# EAGLE design adapter_bluetooth (EAGLE 5.11)
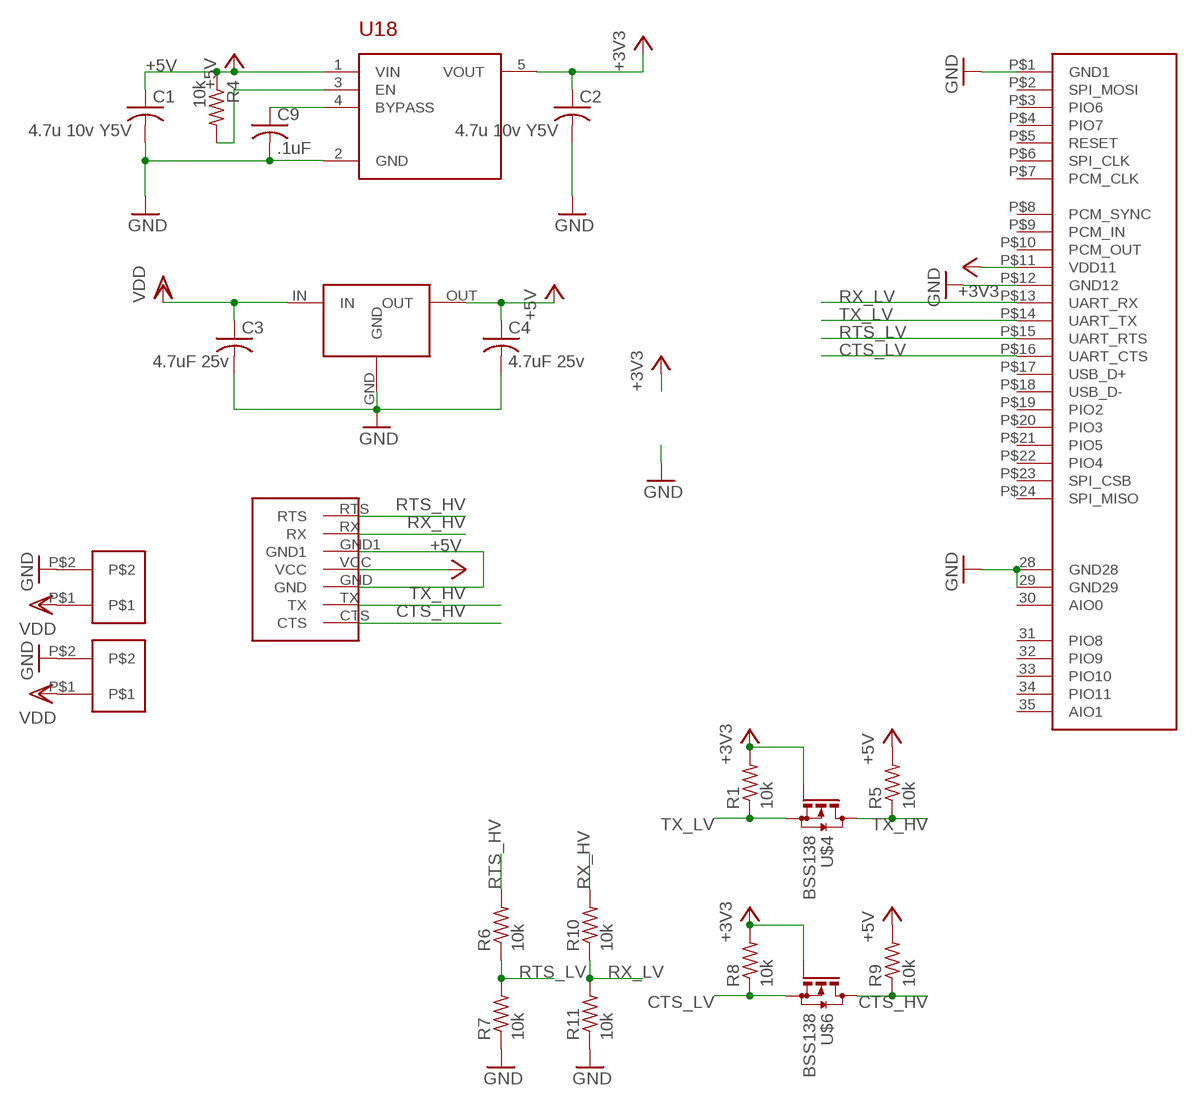
[diagram p0: schematic, sheet 1]

## Parts
C1  4.7u 10v Y5V  C-USC0603  [C0603]
C2  4.7u 10v Y5V  C-USC0603  [C0603]
C3  4.7uF 25v  C-USC0603  [C0603]
C4  4.7uF 25v  C-USC0603  [C0603]
C9  .1uF  C-USC0603  [C0603]
R1  10k  R-US_R0603  [R0603]
R4  10k  R-US_R0603  [R0603]
R5  10k  R-US_R0603  [R0603]
R6  10k  R-US_R0603  [R0603]
R7  10k  R-US_R0603  [R0603]
R8  10k  R-US_R0603  [R0603]
R9  10k  R-US_R0603  [R0603]
R10  10k  R-US_R0603  [R0603]
R11  10k  R-US_R0603  [R0603]
U18  LDS3985XX33  [SOT23-5]
U$1  RN-41  [RN-41]
U$2  L78MXXC  [DPAK]
U$3  2P  [2PTH]
U$4  BSS138  [SOT23]
U$6  BSS138  [SOT23]
U$10  WASP7PIN  [WASP7PIN]
U$19  2P  [2PTH]

## Nets
+3V3: C2.1 R1.2 R8.2 U18.5(VOUT) U$1.P$11(VDD11) U$4.1(G) U$6.1(G)
+5V: C1.1 C4.1 R4.1 R5.2 R9.2 U18.1(VIN) U$2.OUT U$10.VCC
CTS_HV: R9.1 U$6.3(D) U$10.CTS
CTS_LV: R8.1 U$1.P$16(UART_CTS) U$6.2(S)
GND: C1.2 C2.2 C3.2 C4.2 C9.2 R7.1 R11.1 U18.2(GND) U$1.28(GND28) U$1.29(GND29) U$1.P$1(GND1) U$1.P$12(GND12) U$2.GND U$3.P$2 U$10.GND U$10.GND1 U$19.P$2
N$2: R4.2 U18.3(EN)
N$3: C9.1 U18.4(BYPASS)
RTS_HV: R6.2 U$10.RTS
RTS_LV: R6.1 R7.2 U$1.P$15(UART_RTS)
RX_HV: R10.2 U$10.RX
RX_LV: R10.1 R11.2 U$1.P$13(UART_RX)
TX_HV: R5.1 U$4.3(D) U$10.TX
TX_LV: R1.1 U$1.P$14(UART_TX) U$4.2(S)
VDD: C3.1 U$2.IN U$3.P$1 U$19.P$1
Unconnected: U$1.30(AIO0) U$1.31(PIO8) U$1.32(PIO9) U$1.33(PIO10) U$1.34(PIO11) U$1.35(AIO1) U$1.P$2(SPI_MOSI) U$1.P$3(PIO6) U$1.P$4(PIO7) U$1.P$5(RESET) U$1.P$6(SPI_CLK) U$1.P$7(PCM_CLK) U$1.P$8(PCM_SYNC) U$1.P$9(PCM_IN) U$1.P$10(PCM_OUT) U$1.P$17(USB_D+) U$1.P$18(USB_D-) U$1.P$19(PIO2) U$1.P$20(PIO3) U$1.P$21(PIO5) U$1.P$22(PIO4) U$1.P$23(SPI_CSB) U$1.P$24(SPI_MISO)

## Library data of the parts
C1-C4 C9 = rcl:C-US: CAPACITOR, American symbol
R1 R4-R11 = rcl:R-US_: RESISTOR, American symbol
U18 = LDS3985XX33:LDS3985XX33
U$1 = rn-41:RN-41
U$2 = L78MxxC:L78MXXC
U$3 U$19 = con_2h_70555-0001:2P
U$4 U$6 = WASP:BSS138
U$10 = wasp7pin:WASP7PIN

## Board
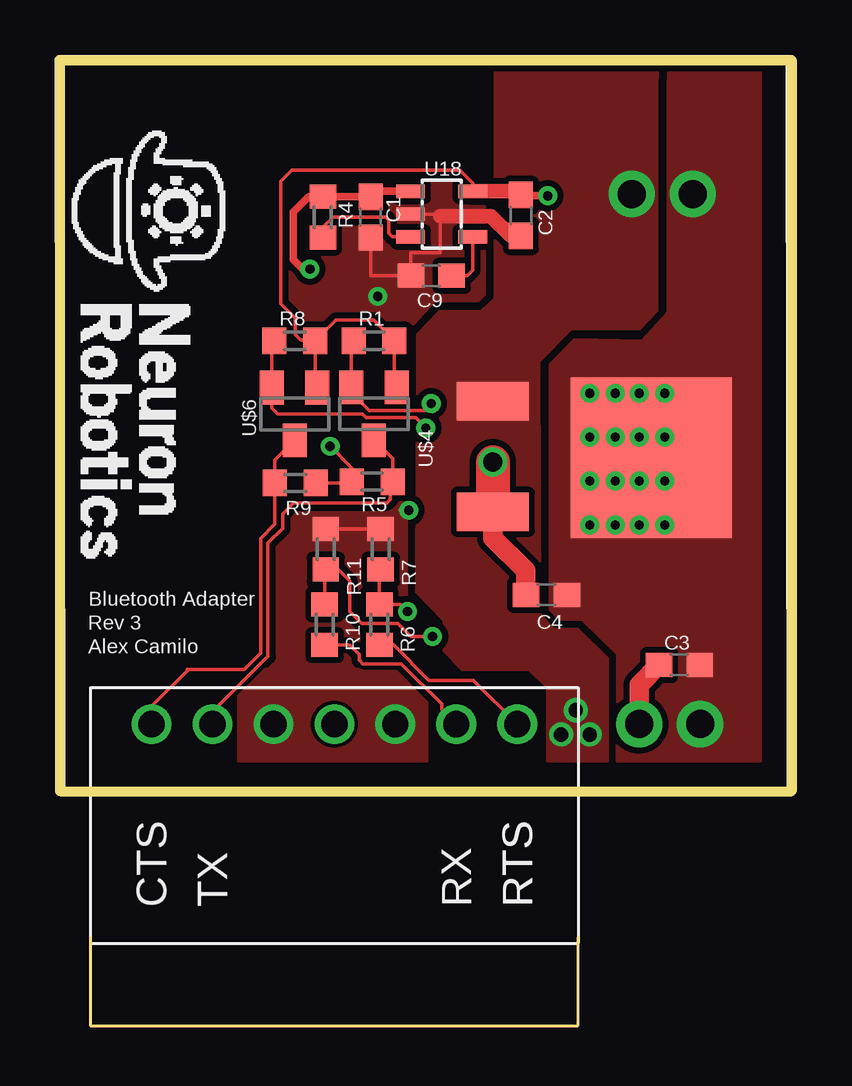
[diagram p1: board, top side]
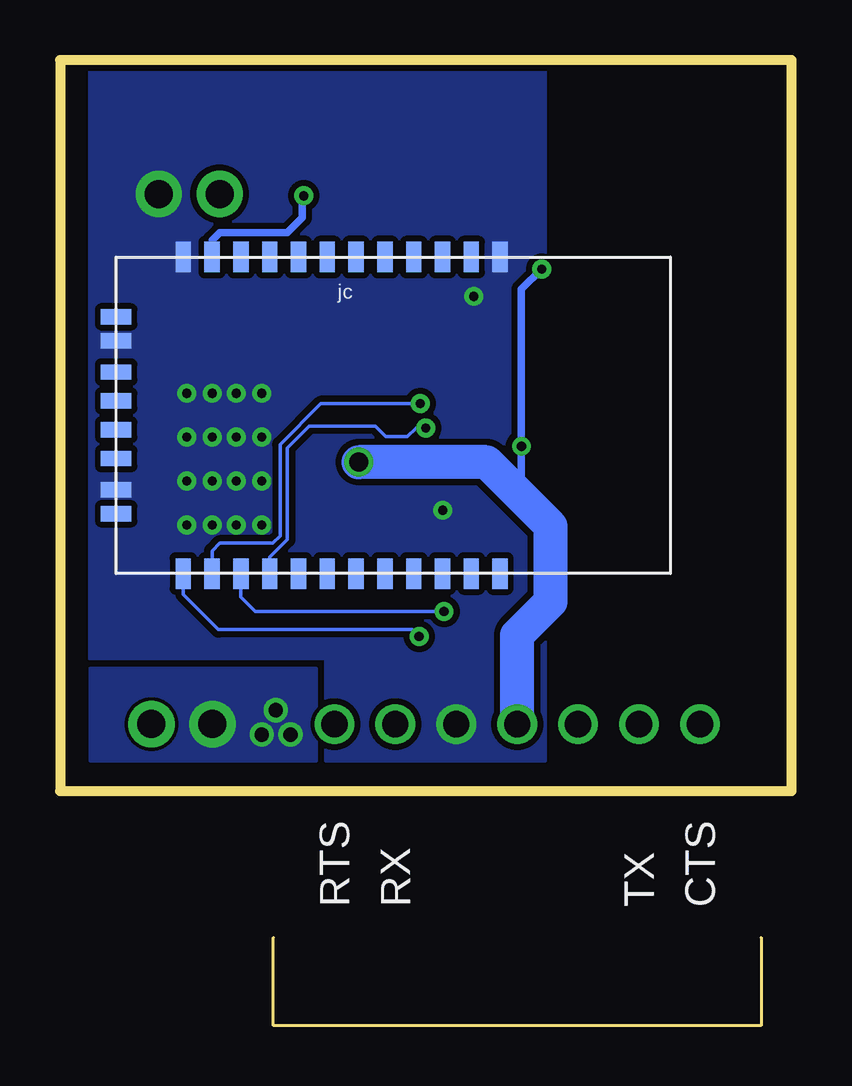
[diagram p2: board, bottom side, seen from below]

Size 30.48 x 30.48 mm. Coordinates in mm from the lower left corner, seen from the top.
Outline: 0,0 30.48,0 30.48,30.48 0,30.48 0,0
Copper layers (1*16): Top 0.035mm / dielectric 1.5mm / Bottom 0.035mm
Design rules "default *": minimum track width 6mil, minimum drill 15mil, track to track 6mil, track to pad 6mil, pad to pad 6mil, via to via 6mil, smd to smd 6mil, copper to edge 6mil, drill to drill 6mil, minimum pad ring 10mil, minimum via ring 8mil, stop-mask expansion 4mil, vias tented up to drill 25mil, thermal gap 10mil

### Footprints (pad centres in the part's own frame; a part is rotated, then mirrored left to right if it is on the bottom)
C0603 = smd 1.1 x 1: 1 -0.85,0; 2 0.85,0
R0603 = smd 1 x 1.1: 1 -0.85,0; 2 0.85,0
SOT23-5 = smd 0.55 x 1.2: 1 -0.95,-1.3; 2 0,-1.3; 3 0.95,-1.3; 4 0.95,1.3; 5 -0.95,1.3
RN-41 = smd 0.635 x 1.27: 28 -3.5,0; 29 -9.7,0; 30 -2.5,0; 31 -4.8,0; 32 -6,0; 33 -7.2,0; 34 -8.4,0; 35 -10.7,0 | smd 1.27 x 0.635: P$1 -13.2,16; P$2 -13.2,14.8; P$3 -13.2,13.6; P$4 -13.2,12.4; P$5 -13.2,11.2; P$6 -13.2,10; P$7 -13.2,8.8; P$8 -13.2,7.6; P$9 -13.2,6.4; P$10 -13.2,5.2; P$11 -13.2,4; P$12 -13.2,2.8; P$13 0,2.8; P$14 0,4; P$15 0,5.2; P$16 0,6.4; P$17 0,7.6; P$18 0,8.8; P$19 0,10; P$20 0,11.2; P$21 0,12.4; P$22 0,13.6; P$23 0,14.8; P$24 0,16
DPAK = smd 6.7 x 6.7: GND 3.4,0.05 | smd 3 x 1.6: IN 10,-2.3; OUT 10,2.3
2PTH = drill 1.168 pad 1.93 round: P$1 -2.54,0; P$2 0,0
SOT23 = smd 1 x 1.4: 1 -0.95,-1.1; 2 0.95,-1.1; 3 0,1.1
WASP7PIN = drill 1.1 round: CTS 0,0; GND 5.08,0; GND1 10.16,0; RTS 15.24,0; RX 12.7,0; TX 2.54,0; VCC 7.62,0

### Placement (x,y rotation side)
C1  12.94,23.93 270 top
C2  19.2,24 270 top
C3  25.81,5.26 0 top
C4  20.27,8.18 0 top
C9  15.47,21.49 180 top
R1  13.08,18.77 0 top
R4  10.95,23.93 270 top
R5  13,12.9 180 top
R6  13.31,6.93 270 top
R7  13.36,10.08 270 top
R8  9.78,18.77 0 top
R9  9.8,12.85 0 top
R10  11.02,6.93 270 top
R11  11.07,10.08 270 top
U18  15.9,24.05 270 top
U$1  28.14,9.07 270 bottom
U$2  28.04,13.94 180 top
U$3  26.37,24.89 0 top
U$4  13.08,15.73 180 top
U$6  9.78,15.72 180 top
U$10  3.81,2.79 0 top
U$19  26.67,2.8 0 top

### Tracks (layer width: path | path; a pad name or v marks a point on that pad's centre or on a via)
+3V3  (via drill 0.38)
  Top 0.152: 19.2,25 C2.1 20.21,24.85 v20.32,24.82 | R8.2 10.63,18.35 10.64,18.34 10.64,16.91 U$6.1 10.73,16.22 | 13.95,16.74 U$4.1 13.93,16.92 R1.2 13.07,19.63 11.49,19.63 R8.2 | U18.5 17.2,25.34 16.66,25.88 9.65,25.88 9.2,25.43 9.2,20.32 9.8,19.71 9.8,19.02 10.03,18.8 10.6,18.8 R8.2
  Top 0.305: v20.32,24.82 19.23,24.82 C2.1
  Top 0.61: U18.5 19.04,25 C2.1
  Bottom 0.152: U$1.P$11 24.14,22.52
  Bottom 0.305: v20.32,24.82 20.4,24.66 20.4,23.9 21.01,23.29 23.82,23.29 24.14,22.97 U$1.P$11
+5V  (via drill 0.38, 0.8)
  Top 0.152: U18.1 | C1.1 | R9.2 12.1,12.85 R5.2 12.15,13.47 v11.25,14.38
  Top 0.305: v10.41,21.77 10.11,21.77 9.73,22.15 9.73,24.13 10.37,24.77 R4.1 C1.1 13.17,25 U18.1
  Top 0.813: C4.1 19.41,8.19 19.41,9.2 18.04,10.56 U$2.OUT
  Top 1.422: U$2.OUT 18.04,13.71 v18.03,13.72
  Bottom 0.152: 11.02,2.79 U$10.VCC | v11.25,14.38 11.25,13.39 11.81,12.83
  Bottom 0.305: 11.25,12.85 v11.25,14.38 11.25,20.93 v10.41,21.77
  Bottom 1.422: v18.03,13.72 12.7,13.72 11.81,12.83 10.03,11.05 10.03,7.9 11.43,6.5 U$10.VCC
CTS_HV
  Top 0.152: 5.36,5.08 5.31,5.08 | 5.36,5.08 7.67,5.08 8.36,5.77 8.36,10.54 8.95,11.14 R9.1 8.95,13.8 U$6.3 | U$10.CTS 3.81,3.53 5.36,5.08
CTS_LV  (via drill 0.38)
  Top 0.152: R8.1 8.83,18.67 U$6.2 8.83,15.96 9.07,15.72 12.6,15.72 12.75,15.57 14.81,15.57 arc-90 14.83,15.54 v15.24,15.14
  Bottom 0.152: 21.72,9.04 U$1.P$16 21.74,9.75 21.01,10.49 21.01,14.3 20.09,15.21 17.35,15.21 16.92,14.78 16,14.78 15.65,15.14 v15.24,15.14
GND  (via drill 0.38)
  Top 0.152: C1.2 12.94,21.49 C9.2 14.62,22.45 15.85,22.45 15.85,23.98 15.85,24.05 U18.2 | R11.1 R7.1 | v14.53,11.71 14.15,11.71
  Top 0.61: C2.2 18.79,23.15 17.96,23.98 15.85,23.98
  other vias: 24.13,16.59 24.13,14.76 24.13,12.93 24.13,11.1 25.2,16.59 25.2,14.76 25.2,12.93 25.2,11.1 23.14,16.59 23.14,14.76 23.14,12.93 23.14,11.1 22.07,16.59 22.07,14.76 22.07,12.93 22.07,11.1 13.23,20.62
  pour Top (isolate 0.254, no thermals): 25.37,39.37 25.35,19.94 24.26,18.77 21.44,18.82 20.42,17.78 20.42,7.57 20.8,7.19 21.74,7.19 23.24,5.71 23.22,1.27 29.18,1.27 29.18,39.37
  pour Top (no thermals): 7.44,1.27 7.44,4.32 8.2,5.08 13.92,5.08 15.29,3.71 15.29,1.27
  pour Bottom (isolate 0.254, no thermals): 29.24,5.51 29.24,52.04 10.26,52.04 10.26,1.27 19.41,1.27 19.41,5.54
  pour Top (isolate 0.254, no thermals): 17.68,26.72 17.68,20.7 17.42,20.45 15.62,20.45 14.45,19.18 14.43,4.93 14.3,4.78 8.51,4.78 8.51,26.72 17.65,26.64
N$2
  Top 0.152: U18.3 14.59,23.11 13.84,23.11 13.69,23.27 13.69,23.8 13.56,23.93 11.38,23.93 10.95,23.5 R4.2
N$3
  Top 0.152: C9.1 16.97,21.49 17.2,21.72 U18.4
RTS_HV
  Top 0.152: R6.2 13.91,6.08 15.37,4.62 17.22,4.62 U$10.RTS
RTS_LV  (via drill 0.38)
  Top 0.152: R7.2 13.31,9.18 R6.1 14.19,7.78 v14.48,7.49
  Bottom 0.152: U$1.P$15 22.94,8.08 22.35,7.49 14.83,7.49 v14.48,7.49
RX_HV
  Top 0.152: R10.2 12.08,6.08 12.47,5.69 12.47,5.46 12.62,5.31 14.22,5.31 15.9,3.63 15.9,3.4 U$10.RX
RX_LV  (via drill 0.38)
  Top 0.152: R10.1 11.02,9.18 R11.2 11.59,9.23 12.06,8.76 12.06,7.49 12.57,6.98 14.07,6.98 14.61,6.45 v15.52,6.45
  Bottom 0.152: U$1.P$13 25.34,8.2 23.88,6.73 15.8,6.73 v15.52,6.45
TX_HV
  Top 0.152: U$4.3 13.86,13.86 R5.1 13.77,12.81 13.77,12.17 13.61,12.01 9.73,12.01 9.27,11.56 9.27,10.95 8.66,10.34 8.66,5.61 6.35,3.3 U$10.TX
TX_LV  (via drill 0.38)
  Top 0.152: R1.1 12.13,18.67 U$4.2 12.57,16.18 12.88,15.88 15.19,15.88 v15.47,16.15
  Bottom 0.152: U$1.P$14 24.14,10.02 23.82,10.34 21.61,10.34 21.31,10.64 21.31,14.45 19.61,16.15 v15.47,16.15
VDD  (via drill 0.6)
  Top 0.813: U$19.P$1 24.13,4.43 C3.1
  other vias: 21.49,3.38 22.07,2.36 20.88,2.36
  pour Bottom (no thermals): 19.81,1.27 29.21,1.27 29.21,5.11 19.81,5.11
  pour Top (isolate 0.254, no thermals): 22.81,1.27 22.81,5.54 21.56,6.73 20.55,6.73 19.99,7.37 19.94,17.91 21.31,19.28 24.13,19.25 24.87,20.04 24.89,39.37 18.11,39.37 18.14,20.52 17.58,20.02 15.82,19.99 14.91,19.02 14.86,8.31 16,7.11 16,5.84 16.76,5.08 19.56,5.08 20.32,4.32 20.32,1.27

### Text on the board
tPlace: Bluetooth Adapter | Rev 3 | Alex Camilo
bPlace: jc